# Altium project TAUV-Interfacer.PrjPCB (part 2 of 2)

## Sheet Interface.SchDoc
size A; SheetNumber: 2
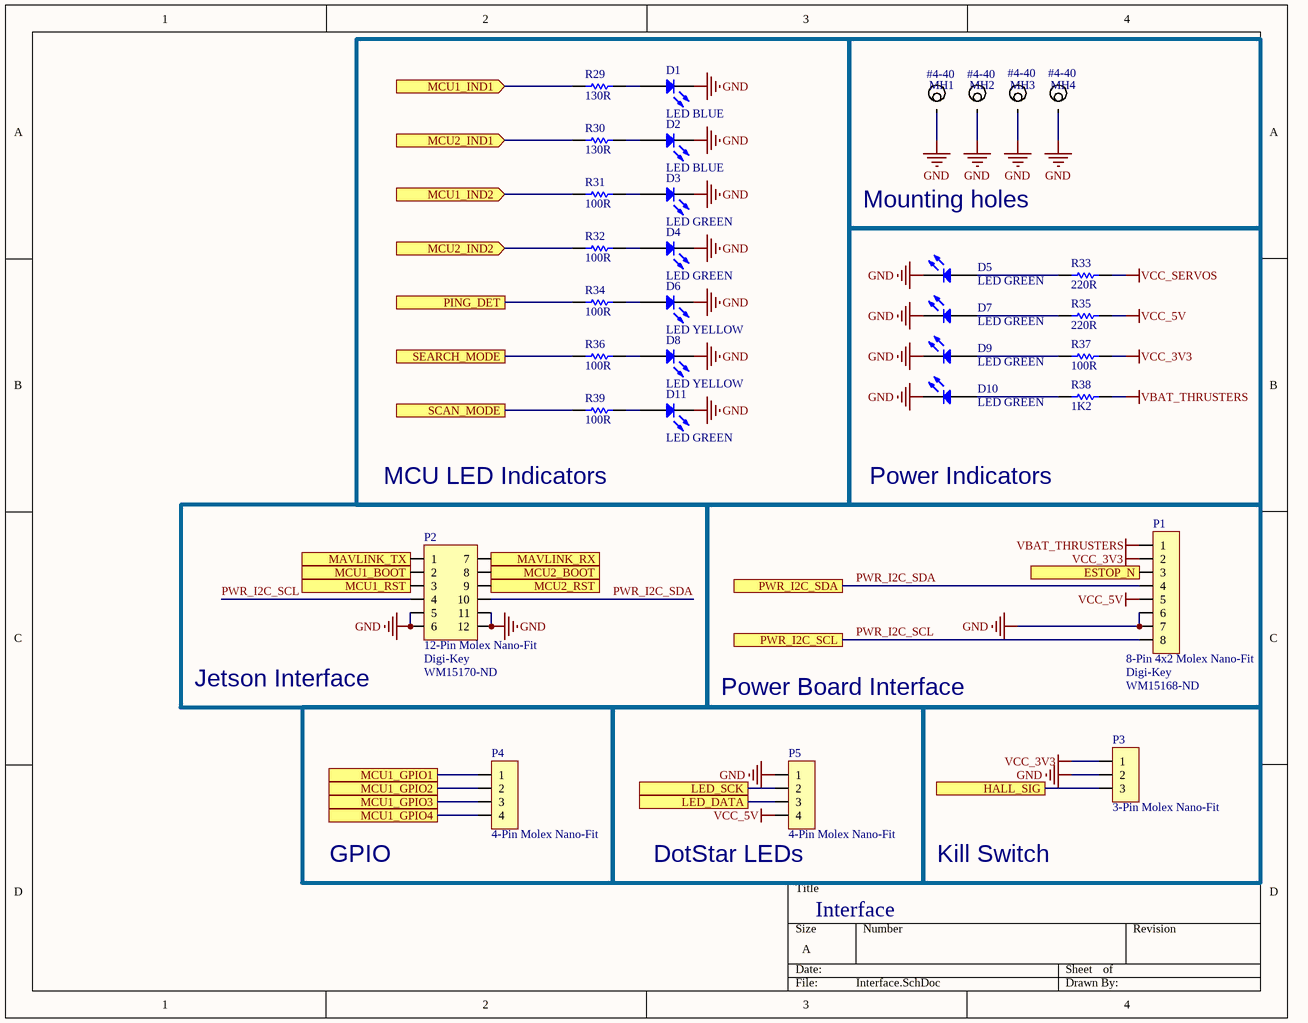
[diagram p9: Interface.SchDoc]

### Parts
D1  LED BLUE  [LED_0805]
D2  LED BLUE  [LED_0805]
D3  LED GREEN  [LED_0805]
D4  LED GREEN  [LED_0805]
D5  LED GREEN  [LED_0805]
D6  LED YELLOW  [LED_0805]
D7  LED GREEN  [LED_0805]
D8  LED YELLOW  [LED_0805]
D9  LED GREEN  [LED_0805]
D10  LED GREEN  [LED_0805]
D11  LED GREEN  [LED_0805]
MH1  #4-40  [Mounting Hole #4-40]
MH2  #4-40  [Mounting Hole #4-40]
MH3  #4-40  [Mounting Hole #4-40]
MH4  #4-40  [Mounting Hole #4-40]
P1  8-Pin 4x2 Molex Nano-Fit  Supplier 1: Digi-Key  Supplier Part Number 1: WM15168-ND  [MOLEX NANO-FIT 2x4]
P2  12-Pin Molex Nano-Fit  Supplier 1: Digi-Key  Supplier Part Number 1: WM15170-ND  [MOLEX NANO-FIT 2X6 - Right Angle]
P3  3-Pin Molex Nano-Fit  [MOLEX NANO-FIT 1X3]
P4  4-Pin Molex Nano-Fit  [MOLEX NANO-FIT 1X4]
P5  4-Pin Molex Nano-Fit  [MOLEX NANO-FIT 1X4]
R29  130R  [RESC0603(1608)_N]
R30  130R  [RESC0603(1608)_N]
R31  100R  [RESC0603(1608)_N]
R32  100R  [RESC0603(1608)_N]
R33  220R  [RESC0603(1608)_N]
R34  100R  [RESC0603(1608)_N]
R35  220R  [RESC0603(1608)_N]
R36  100R  [RESC0603(1608)_N]
R37  100R  [RESC0603(1608)_N]
R38  1K2  [RESC0603(1608)_N]
R39  100R  [RESC0603(1608)_N]

### Blocks framed on the sheet
MCU LED Indicators: D1-D4 D6 D8 D11 R29-R32 R34 R36 R39
Mounting holes: MH1-MH4
Power Indicators: D5 D7 D9 D10 R33 R35 R37 R38
GPIO: P4
Kill Switch: P3

### Ports
ESTOP_N, HALL_SIG, LED_DATA, LED_SCK, MAVLINK_RX, MAVLINK_TX, MCU1_BOOT (in), MCU1_GPIO1, MCU1_GPIO2, MCU1_GPIO3, MCU1_GPIO4, MCU1_IND1 (in), MCU1_IND2 (in), MCU1_RST (in), MCU2_BOOT (in), MCU2_IND1 (in), MCU2_IND2 (in), MCU2_RST (in), PING_DET, PWR_I2C_SCL, PWR_I2C_SDA, SCAN_MODE, SEARCH_MODE

### Nets
GND: D1.1(K) D2.1(K) D3.1(K) D4.1(K) D5.1(K) D6.1(K) D7.1(K) D8.1(K) D9.1(K) D10.1(K) D11.1(K) MH1.0 MH2.0 MH3.0 MH4.0 P1.6 P1.7 P2.5 P2.6 P2.11 P2.12 P3.2 P5.1
VBAT_THRUSTERS: P1.1 R38.2
VCC_3V3: P1.2 P3.1 R37.2
VCC_5V: P1.5 P5.4 R35.2
VCC_SERVOS: R33.2
HALL_SENSE: P1.3 ; port ESTOP_N
IND_PING: R34.1 ; port PING_DET
IND_SCAN: R39.1 ; port SCAN_MODE
IND_SEARCH: R36.1 ; port SEARCH_MODE
MCU1_BOOT: P2.2 ; port MCU1_BOOT
MCU1_GPIO1: P4.1 ; port MCU1_GPIO1
MCU1_GPIO2: P4.2 ; port MCU1_GPIO2
MCU1_GPIO3: P4.3 ; port MCU1_GPIO3
MCU1_GPIO4: P4.4 ; port MCU1_GPIO4
MCU1_IND1: R29.1 ; port MCU1_IND1
MCU1_IND2: R31.1 ; port MCU1_IND2
MCU1_SPI1_MOSI: P5.3 ; port LED_DATA
MCU1_SPI1_SCK: P5.2 ; port LED_SCK
MCU1_UART4_RX: P2.7 ; port MAVLINK_RX
MCU1_UART4_TX: P2.1 ; port MAVLINK_TX
MCU2_BOOT: P2.8 ; port MCU2_BOOT
MCU2_IND1: R30.1 ; port MCU2_IND1
MCU2_IND2: R32.1 ; port MCU2_IND2
PWR_I2C_SCL: P1.8 P2.4 ; port PWR_I2C_SCL  [project net MCU1_I2C_SCL]
PWR_I2C_SDA: P1.4 P2.10 ; port PWR_I2C_SDA  [project net MCU1_I2C_SDA]
NetD1_2: D1.2(A) R29.2
NetD2_2: D2.2(A) R30.2
NetD3_2: D3.2(A) R31.2
NetD4_2: D4.2(A) R32.2
NetD5_2: D5.2(A) R33.1
NetD6_2: D6.2(A) R34.2
NetD7_2: D7.2(A) R35.1
NetD8_2: D8.2(A) R36.2
NetD9_2: D9.2(A) R37.1
NetD10_2: D10.2(A) R38.1
NetD11_2: D11.2(A) R39.2
NetP2_3: P2.3 ; port MCU1_RST
NetP2_9: P2.9 ; port MCU2_RST
NetP3_3: P3.3 ; port HALL_SIG

### Notes on the sheet
- (near P2) Jetson Interface
- Power Board Interface
- (near P5) DotStar LEDs
- Interface

### Library data of the parts
D1 D2 = LED0: led; Manufacturer 1: Kingbright; Manufacturer Part Number 1: APT2012LVBC/D; Lens Colour: Colorless; Lens Transparency: Clear; Luminous Intensity: 24mcd; Test Current: 2mA; Viewing Angle: 120°; Dominant Wavelength: 470nm; Forward Voltage: 2.65V; Supplier 1: Digi-Key; Supplier Part Number 1: 754-1938-1-ND; Stock 1: 44757; Pricing 1: 1=0.69, 10=0.541, 25=0.4508, 100=0.3885, 250=0.3469, 500=0.2983, 1000=0.2303 (USD); Mount: Surface Mount; Case/Package: 0805; Colour: Blue; Case Code (Metric): 2012; Case Code (Imperial): 0805; Packaging: Tape and Reel; Length: 2mm; Height: 0.75mm; Width: 1.25mm; Lead Free: Lead Free; ComponentLink1URL: http://www.mouser.com/ds/2/216/APT2012LVBC-D-535767.pdf; ComponentLink1Description: http://www.mouser.com/ds/2/216/APT2012LVBC-D-535767.pdf; ComponentLink2URL: http://www.kingbrightusa.com/images/catalog/SPEC/APT2012LVBC-D.pdf; ComponentLink2Description: http://www.kingbrightusa.com/images/catalog/SPEC/APT2012LVBC-D.pdf
D3-D5 D7 D9-D11 = LED0: led; Manufacturer: Lite-On Inc.; Manufacturer Part Number: LTST-C171KGKT; Lens Color: Colorless; Lens Transparency: Clear; Millicandela Rating: 35mcd; Lens Style/Size: Rectangle with Flat Top, 1.40mm x 1.25mm; Voltage - Forward (Vf) (Typ): 2V; Current - Test: 20mA; Viewing Angle: 130°; Wavelength - Dominant: 571nm; Wavelength - Peak: 574nm; Supplier 1: Digi-Key; Supplier Part Number 1: 160-1426-1-ND; RoHS: RoHS Compliant; Category: Optoelectronics; Stock 1: 350441; Pricing 1: 1=0.31, 10=0.225, 25=0.1656, 100=0.1183, 250=0.0804, 500=0.07096, 1000=0.05558 (USD); Packaging: Cut Tape (CT); Part Status: Active; Color: Green; Mounting Type: Surface Mount; Features: -; Package / Case: 0805 (2012 Metric); Size / Dimension: 2.00mm L x 1.25mm W; Height (Max): 0.90mm; ComponentLink1URL: http://optoelectronics.liteon.com/upload/download/DS22-2000-118/LTST-C171KGKT.pdf; ComponentLink1Description: http://optoelectronics.liteon.com/upload/download/DS22-2000-118/LTST-C171KGKT.pdf
D6 D8 = LED0: led / LTST-C171KSKT; Manufacturer: Lite-On Inc.; Manufacturer Part Number: LTST-C171KGKT; Color: Green; Lens Color: Colorless; Lens Transparency: Clear; Millicandela Rating: 35mcd; Lens Style/Size: Rectangle with Flat Top, 1.40mm x 1.25mm; Voltage - Forward (Vf) (Typ): 2V; Current - Test: 20mA; Viewing Angle: 130°; Wavelength - Dominant: 571nm; Wavelength - Peak: 574nm; Supplier 1: Digi-Key; Supplier Part Number 1: 160-1426-1-ND; RoHS: RoHS Compliant; Category: Optoelectronics; Stock 1: 350441; Pricing 1: 1=0.31, 10=0.225, 25=0.1656, 100=0.1183, 250=0.0804, 500=0.07096, 1000=0.05558 (USD); Packaging: Cut Tape (CT); Part Status: Active; Mounting Type: Surface Mount; Features: -; Package / Case: 0805 (2012 Metric); Size / Dimension: 2.00mm L x 1.25mm W; Height (Max): 0.90mm; ComponentLink1URL: http://optoelectronics.liteon.com/upload/download/DS22-2000-110/LTST-C171KSKT.pdf; ComponentLink1Description: http://optoelectronics.liteon.com/upload/download/DS22-2000-110/LTST-C171KSKT.pdf
MH1-MH4 = Mounting Hole #4-40, Loose Fit: Mounting Hole for ANSI #4-40 w/ Flat Washer, Loose Fit; Datasheet: http://blogs.mentor.com/tom-hausherr/blog/tag/pcb-mounting-holes/
P1 = 8-Pin 2-Row Nano-Fit: NanoFit RA Hdr TH DR 8Ckt; Part Number: 105314-1216; Supplier: Digi-Key; Manufacturer: Molex; Supplier Part Number: WM15165-ND
P2 = 12-Pin 2-Row Nano-Fit: NanoFit RA Hdr TH DR 12Ckt; ComponentLink1Description: Digikey Link; ComponentLink1URL: https://www.digikey.com/product-detail/en/molex-llc/1053141312/WM15170-ND/6164259
P3 = 3-Pin Nano-Fit: NanoFit RA Hdr TH SR 3Ckt; Part Number: 105313-1204; Supplier: Mouser; Manufacturer: Molex; Supplier Part Number: 538-105313-1204
P4 P5 = 4-Pin Nano-Fit: NanoFit RA Hdr TH SR 4Ckt; Part Number: 105313-1204; Supplier: Mouser; Manufacturer: Molex; Supplier Part Number: 538-105313-1204
R29 R30 = CMP-1012-00409-1: 130R 0.1W 1% 0603 (1608 Metric)  SMD; Case-Metric: 1608; Case-EIA: 0603; Value: 130.00 Ohm; Power: 0.1 W; Tolerance: 1 %; Technology: SMT
R31 R32 R34 R36 R37 R39 = CMP-1012-00050-1: 100R 0.1W 5% 0603 (1608 Metric)  SMD; Case-EIA: 0603; Value: 100.00 Ohm; Case-Metric: 1608; Tolerance: 5 %; Technology: SMT; Power: 0.1 W
R33 R35 = CMP-1012-00058-1: 220R 0.1W 5% 0603 (1608 Metric)  SMD; Case-EIA: 0603; Case-Metric: 1608; Value: 220.00 Ohm; Technology: SMT; Power: 0.1 W; Tolerance: 5 %
R38 = CMP-1012-00518-1: 1K2 0.1W 1% 0603 (1608 Metric)  SMD; Case-EIA: 0603; Value: 1200.00 Ohm; Case-Metric: 1608; Power: 0.1 W; Technology: SMT; Tolerance: 1 %

## Sheet Hall_Effect.SchDoc
size A; SheetNumber: 9
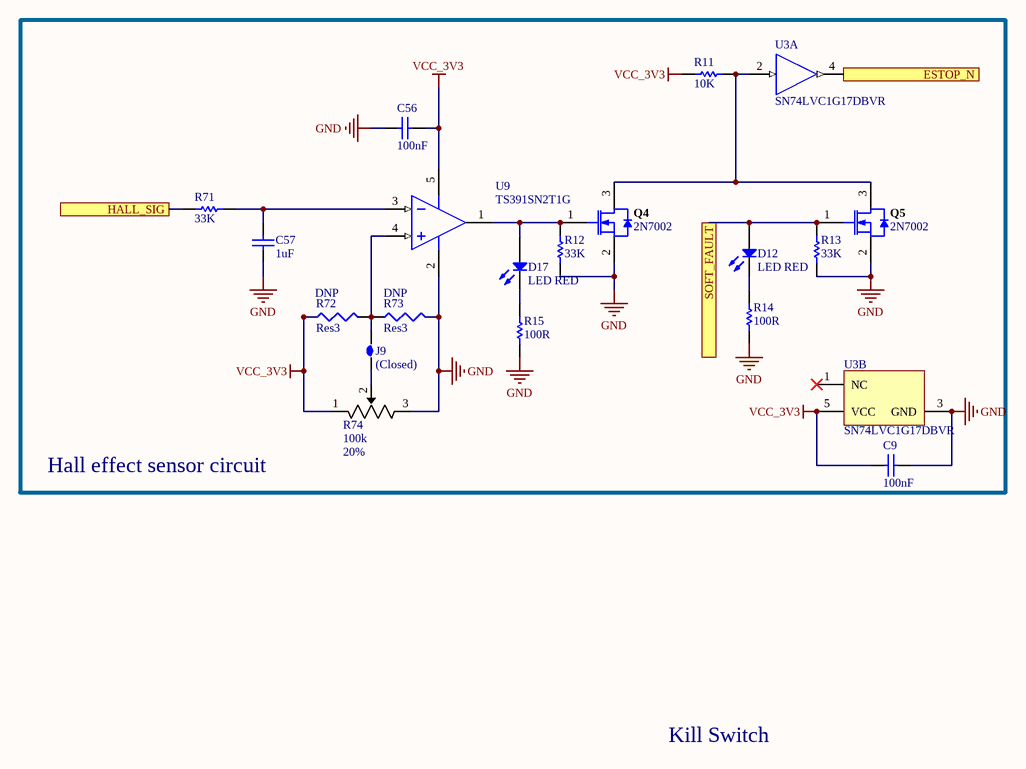
[diagram p10: Hall_Effect.SchDoc]

### Parts
(Parts that share a designator on the sheet are numbered #1, #2 ... from top to bottom, then left to right.)
C9#2  100nF  [CAPC0603(1608)100_N]
C56  100nF  [CAPC0603(1608)100_N]
C57  1uF  [CAPC0603(1608)100_N]
D12  LED RED  [LED_0805]
D17  LED RED  [LED_0805]
J9  (Closed)  [Solder Jumper - Closed]
Q4  2N7002  [INF-PG-SOT23_M]
Q5  2N7002  [INF-PG-SOT23_M]
R11#2  10K  [RESC0603(1608)_N]
R12#2  33K  [RESC0603(1608)_N]
R13#2  33K  [RESC0603(1608)_N]
R14#2  100R  [RESC0603(1608)_N]
R15#2  100R  [RESC0603(1608)_N]
R71  33K  [RESC0603(1608)_N]
R72  Res3  value DNP  [J1-0603]
R73  Res3  value DNP  [J1-0603]
R74  value 100k  Tolerance: 20%  [TT BI 22A TRIM POT]  (hidden comment: 22AR100KLFTR)
U3#2  SN74LVC1G17DBVR  [DBV0005A_M]  (parts A,B of 2)
U9  TS391SN2T1G  [ONSC-TSOP-5-483-02_V]

### Blocks framed on the sheet
Hall effect sensor circuit: C9#2 C56 C57 D12 D17 J9 Q4 Q5 R11#2 R12#2 R13#2 R14#2 R15#2 R71-R74 U3#2 U9

### Ports
ESTOP_N, HALL_SIG, SOFT_FAULT

### Nets
GND: C9#2.1 C56.2 C57.1 Q4.2(SOURCE) Q5.2(SOURCE) R12#2.2 R13#2.2 R14#2.2 R15#2.2 R73.2 R74.3 U3#2.3(GND) U9.2(VEE)
VCC_3V3: C9#2.2 C56.1 R11#2.2 R72.1 R74.1 U3#2.5(VCC) U9.5(VCC)
HALL_SENSE: U3#2.4(Y) ; port ESTOP_N
MCU1_SOFT_FAULT: D12.2(A) Q5.1(GATE) R13#2.1 ; port SOFT_FAULT
NetC57_2: C57.2 R71.2 U9.3(IN-)
NetD12_1: D12.1(K) R14#2.1
NetD17_1: D17.1(K) R15#2.1
NetD17_2: D17.2(A) Q4.1(GATE) R12#2.1 U9.1(OUT)
NetJ9_1: J9.1 R74.2
NetJ9_2: J9.2 R72.2 R73.1 U9.4(IN+)
NetP3_3: R71.1 ; port HALL_SIG
NetQ4_3: Q4.3(DRAIN) Q5.3(DRAIN) R11#2.1 U3#2.2(A)

Not connected (* = marked no-connect by the designer): U3#2 1(NC)*

### Notes on the sheet
- Kill Switch

### Library data of the parts
C9#2 C56 = CMP-1035-02580-1: as C2#1 on sheet Hydrophones; Max Thickness: 1 mm; Value: 100nF; Rated Voltage: 10 V; Technology: SMT
C57 = CMP-1035-02733-1: as C1#1 on sheet Hydrophones; Rated Voltage: 10 V; Max Thickness: 1 mm; Value: 1uF; Technology: SMT
D12 D17 = LED0: led; Manufacturer: Lite-On Inc.; Manufacturer Part Number: LTST-C171KRKT; Lens Color: Colorless; Lens Transparency: Clear; Millicandela Rating: 54mcd; Lens Style/Size: Rectangle with Flat Top, 1.40mm x 1.25mm; Voltage - Forward (Vf) (Typ): 2V; Current - Test: 20mA; Viewing Angle: 130°; Wavelength - Dominant: 631nm; Wavelength - Peak: 639nm; Supplier 1: Digi-Key; Supplier Part Number 1: 160-1427-1-ND; RoHS: RoHS Compliant; Category: Optoelectronics; Stock 1: 260544; Pricing 1: 1=0.31, 10=0.225, 25=0.1656, 100=0.1183, 250=0.0804, 500=0.07096, 1000=0.05558 (USD); Packaging: Cut Tape (CT); Part Status: Active; Color: Red; Mounting Type: Surface Mount; Features: -; Package / Case: 0805 (2012 Metric); Size / Dimension: 2.00mm L x 1.25mm W; Height (Max): 0.80mm; ComponentLink1URL: http://optoelectronics.liteon.com/upload/download/DS22-2000-109/LTST-C171KRKT.pdf; ComponentLink1Description: http://optoelectronics.liteon.com/upload/download/DS22-2000-109/LTST-C171KRKT.pdf
J9 = Jumper Closed: Jumper
Q4 Q5 = CMP-1149-00026-1: N-Channel OptiMOS Small-Signal-Transistor, 60 V VDS, 0.3 A ID, -55 to 150 degC, PG-SOT23, Reel, Green; Manufacturer: Infineon; RDS (on) (max) (@4.5V): 4,000 mOhm; VDS (max): 60 V; IDpuls (max): 1.2Â A; QG: 0.4Â nC; RDS (on) (max): 3,000 mOhm; RthJA (max): 250 K/W; ID (max): 0.3Â A; VGS(th) (max): 2.5Â V; VGS(th) (min): 1.5Â V; Green: TRUE; Ptot (max): 0.5Â W; PackageDescription: 3-Pin Small Outline Transistor Package, 2.9 x 1.3 mm Body, 0.95 mm Pitch; Halogen-free: TRUE; ComponentLink2Description: Datasheet; ComponentLink1URL: http://www.infineon.com/; Packing: Reel; DatasheetVersion: Rev. 2.4; PartNumber: 2N7002; PackageReference: PG-SOT23; PackageVersion: Apr-08; ComponentLink3URL: http://www.infineon.com/dgdl/SOT23-Package_Overview.pdf?folderId=db3a30431936bc4b0119532290053c66&fileId=db3a30431936bc4b0119533468123c85; ComponentLink1Description: Manufacturer URL; Mounting Technology: Surface Mount; ComponentLink3Description: Package Specification; ComponentLink2URL: http://www.infineon.com/dgdl/2N7002_Rev2.4.pdf?folderId=db3a3043156fd573011622e10b5c1f67&fileId=db3a304319bc939a0119c2a9461e79e6
R11#2 = CMP-1012-00098-1: 10K 0.1W 5% 0603 (1608 Metric)  SMD; Case-EIA: 0603; Value: 10000.00 Ohm; Case-Metric: 1608; Technology: SMT; Tolerance: 5 %; Power: 0.1 W
R12#2 R13#2 R71 = CMP-1012-00680-1: 33K 0.1W 1% 0603 (1608 Metric)  SMD; Case-EIA: 0603; Value: 33000.00 Ohm; Case-Metric: 1608; Tolerance: 1 %; Power: 0.1 W; Technology: SMT
R14#2 R15#2 = CMP-1012-00050-1: as R31 on sheet Interface; Tolerance: 5 %; Technology: SMT; Power: 0.1 W
R72 R73 = Res3: Resistor; Published: 8-Jun-2000; LatestRevisionDate: 29-May-2009; LatestRevisionNote: IPC-7351 Footprint Added.; PackageReference: J1-0603; Publisher: Altium Limited; PackageDescription: Chip Resistor
R74 = TT 22AR Trim Pot: TT Electronics BI 22AR100KLFTR SMT trim pot, 100k 20%; Supplier 1: Digi-Key; Supplier Part Number 1: 987-1003-1-ND; Datasheet: http://www.bitechnologies.com/pdfs/22.pdf
U3#2 = CMP-0859-00033-1: Single Schmitt-Trigger Buffer, DBV0005A, LARGE T&R; Schmitt Trigger: Yes; Output Type: CMOS; Logic: True; F @ Nom Voltage(Max)(Mhz): 150; 3-State Output: No; VCC(Max)(V): 5.5; VCC(Min)(V): 1.65; tpd @ Nom Voltage(Max)(ns): 11,6.5,5.5,5; Voltage(Nom)(V): 1.8,2.5,3.3,5; Output Drive (IOL/IOH)(Max)(mA): 32/-32; Rating: Catalog; Sub-Family: Non-Inverting Buffer/Driver; Bits(#): 1; Technology Family: LVC; Input Type: CMOS/TTL; ICC @ Nom Voltage(Max)(mA): 0.01; Operating Temperature Range(C): -40 to 125,-40 to 85; ComponentLink2URL: http://www.ti.com/lit/ds/symlink/sn74lvc1g17.pdf; PackageReference: DBV0005A; PartNumber: SN74LVC1G17DBVR; Part Number: SN74LVC1G17; ComponentLink1URL: http://www.ti.com/; DatasheetVersion: SCES351V; ComponentLink1Description: Manufacturer URL; ComponentLink2Description: Datasheet
U9 = CMP-1305-00060-1: Low Power Single Voltage Comparator, 2 to 36 V, -40 to 125 degC, 5-Pin TSOP, Pb-Free, Tape and Reel; Manufacturer: On Semiconductor; VCC Min (V): 2; VCC Max (V): 36; ICC Typ (mA): 0.5; IO Typ (mA): 16; DatasheetVersion: Rev. 3; Mounting Technology: Surface Mount; PackageVersion: Rev. K, 04/2013; ComponentLink2Description: Datasheet; ComponentLink3Description: Package Specification; ComponentLink3URL: http://www.onsemi.com/pub_link/Collateral/483.PDF; ComponentLink2URL: http://www.onsemi.com/pub_link/Collateral/TS391-D.PDF; Packing: Tape and Reel; ComponentLink1Description: Manufacturer URL; ComponentLink1URL: http://www.onsemi.com/; PackageReference: TSOP-5-483-02; PackageDescription: 5-Pin Small Outline Package, Body 3 x 1.5 mm, Pitch 0.95 mm; PartNumber: TS391SN2T1G; RoHS: TRUE

## Sheet Hydrophone.SchDoc
size A4
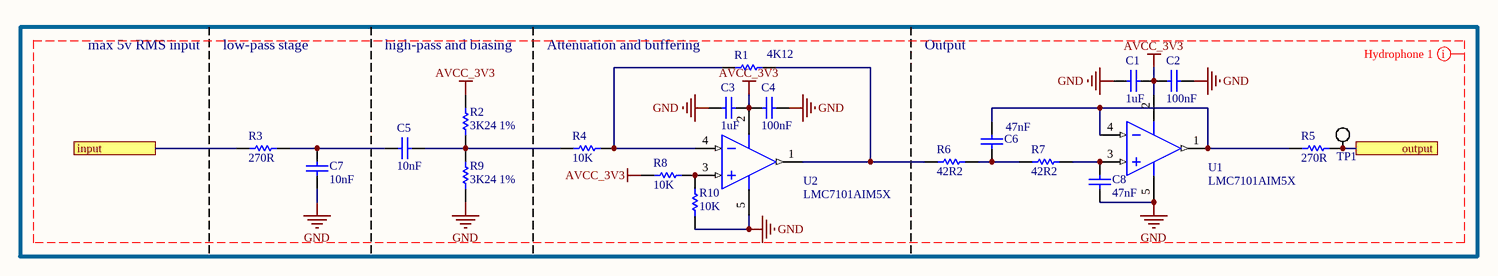
[diagram p11: Hydrophone.SchDoc]

### Parts
(Parts that share a designator on the sheet are numbered #1, #2 ... from top to bottom, then left to right.)
C1#2  1uF  [CAPC0603(1608)100_N]
C2#2  100nF  [CAPC0603(1608)100_N]
C3#2  1uF  [CAPC0603(1608)100_N]
C4#2  100nF  [CAPC0603(1608)100_N]
C5#2  10nF  [CAPC0603(1608)100_N]
C6#2  47nF  [CAPC0603(1608)100_N]
C7#2  10nF  [CAPC0603(1608)100_N]
C8#2  47nF  [CAPC0603(1608)100_N]
R1#2  4K12  [RESC0603(1608)_N]
R2#2  3K24 1%  [RESC0603(1608)_N]
R3#2  270R  [RESC0603(1608)_N]
R4#2  10K  [RESC0603(1608)_N]
R5#2  270R  [RESC0603(1608)_N]
R6#2  42R2  [RESC0603(1608)_N]
R7#2  42R2  [RESC0603(1608)_N]
R8#2  10K  [RESC0603(1608)_N]
R9#2  3K24 1%  [RESC0603(1608)_N]
R10#2  10K  [RESC0603(1608)_N]
TP1#2  Test Point Loop  [Test Point Loop - Black]  (value not drawn)
U1#2  LMC7101AIM5X  [DBV0005A_N]
U2#2  LMC7101AIM5X  [DBV0005A_N]

### Ports
input, output

### Nets
AVCC_3V3: C1#2.1 C2#2.2 C3#2.1 C4#2.2 R2#2.2 R8#2.1 U1#2.2(V+) U2#2.2(V+)
GND: C1#2.2 C2#2.1 C3#2.2 C4#2.1 C7#2.1 C8#2.1 R9#2.1 R10#2.1 U1#2.5(V-) U2#2.5(V-)
NetC5#2_1: C5#2.1 C7#2.2 R3#2.2
NetC5#2_2: C5#2.2 R2#2.1 R4#2.1 R9#2.2
NetC6#2_1: C6#2.1 R6#2.2 R7#2.1
NetC6#2_2: C6#2.2 R5#2.1 U1#2.1(OUT) U1#2.4(IN-)
NetC8#2_2: C8#2.2 R7#2.2 U1#2.3(IN+)
NetR1#2_1: R1#2.1 R4#2.2 U2#2.4(IN-)
NetR1#2_2: R1#2.2 R6#2.1 U2#2.1(OUT)
NetR3#2_1: R3#2.1 ; port input
NetR5#2_2: R5#2.2 TP1#2.1 ; port output
NetR8#2_2: R8#2.2 R10#2.2 U2#2.3(IN+)

### Layout directives
net class Hydrophone1: AVCC_3V3, GND

### Notes on the sheet
- max 5v RMS input
- low-pass stage
- high-pass and biasing
- (near R1#2) Attenuation and buffering
- Output

### Library data of the parts
C1#2 = CMP-1035-02733-1: as C1#1 on sheet Hydrophones; Rated Voltage: 10 V; Max Thickness: 1 mm; Value: 1uF; Technology: SMT
C2#2 = CMP-1035-02580-1: as C2#1 on sheet Hydrophones; Max Thickness: 1 mm; Value: 100nF; Rated Voltage: 10 V; Technology: SMT
C3#2 = CMP-1035-02733-1: CAP 1uF 10V ±10% 0603 (1608 Metric) Thickness 1mm SMD; Tolerance: Â±10%; Case-EIA: 0603; Case-Metric: 1608; ChannelOffset: 8; Rated Voltage: 10 V; Max Thickness: 1 mm; Value: 1uF; Technology: SMT
C4#2 = CMP-1035-02580-1: CAP 100nF 10V ±10% 0603 (1608 Metric) Thickness 1mm SMD; Tolerance: Â±10%; Case-EIA: 0603; Case-Metric: 1608; ChannelOffset: 9; Max Thickness: 1 mm; Value: 100nF; Rated Voltage: 10 V; Technology: SMT
C5#2 = CMP-1035-02314-1: CAP 10nF 25V ±1% 0603 (1608 Metric) Thickness 1mm SMD; Case-EIA: 0603; Tolerance: Â±1%; Case-Metric: 1608; ChannelOffset: 3; Technology: SMT; Value: 10nF; Rated Voltage: 25 V; Max Thickness: 1 mm
C6#2 C8#2 = CMP-1035-02506-1: CAP 47nF 25V ±5% 0603 (1608 Metric) Thickness 1mm SMD; Tolerance: Â±5%; Case-Metric: 1608; Case-EIA: 0603; Max Thickness: 1 mm; Rated Voltage: 25 V; Value: 47nF; Technology: SMT
C7#2 = CMP-1035-02314-1: CAP 10nF 25V ±1% 0603 (1608 Metric) Thickness 1mm SMD; Case-EIA: 0603; Tolerance: Â±1%; Case-Metric: 1608; ChannelOffset: 2; Technology: SMT; Value: 10nF; Rated Voltage: 25 V; Max Thickness: 1 mm
R1#2 = CMP-1012-00579-1: 4K12 0.1W 1% 0603 (1608 Metric)  SMD; Case-EIA: 0603; Value: 4120.00 Ohm; Case-Metric: 1608; Technology: SMT; Tolerance: 1 %; Power: 0.1 W; Parameter 1: *
R2#2 = CMP-1012-00566-1: 3K24 0.1W 1% 0603 (1608 Metric)  SMD; Value: 3240.00 Ohm; Case-Metric: 1608; Case-EIA: 0603; ChannelOffset: 3; Tolerance: 1 %; Technology: SMT; Power: 0.1 W
R3#2 = CMP-1012-00444-1: 270R 0.1W 1% 0603 (1608 Metric)  SMD; Value: 270.00 Ohm; Case-EIA: 0603; Case-Metric: 1608; ChannelOffset: 1; Technology: SMT; Power: 0.1 W; Tolerance: 1 %
R4#2 = CMP-1012-00623-1: 10K 0.1W 1% 0603 (1608 Metric)  SMD; Value: 10000.00 Ohm; Case-EIA: 0603; Case-Metric: 1608; ChannelOffset: 5; Power: 0.1 W; Tolerance: 1 %; Technology: SMT
R5#2 = CMP-1012-00444-1: as R3#1 on sheet Hydrophones; Technology: SMT; Power: 0.1 W; Tolerance: 1 %
R6#2 R7#2 = CMP-1012-00354-1: 42R2 0.1W 1% 0603 (1608 Metric)  SMD; Case-Metric: 1608; Case-EIA: 0603; Value: 42.20 Ohm; Tolerance: 1 %; Power: 0.1 W; Technology: SMT
R8#2 R10#2 = CMP-1012-00623-1: 10K 0.1W 1% 0603 (1608 Metric)  SMD; Value: 10000.00 Ohm; Case-EIA: 0603; Case-Metric: 1608; ChannelOffset: 6; Power: 0.1 W; Tolerance: 1 %; Technology: SMT
R9#2 = CMP-1012-00566-1: 3K24 0.1W 1% 0603 (1608 Metric)  SMD; Value: 3240.00 Ohm; Case-Metric: 1608; Case-EIA: 0603; ChannelOffset: 4; Tolerance: 1 %; Technology: SMT; Power: 0.1 W
TP1#2 = Test Point Loop: Keyston Electronics 5001 Test Point Loop; Manufacturer P/N: 5001; Manufacturer: Keystone Electronics; Color: Black; Supplier 1: Digi-Key; Supplier Part Number 1: 36-5001-ND
U1#2 = CMP-0055-01331-3: as U1#1 on sheet Hydrophones; Package Reference: DBV0005A; ComponentLink1URL: http://www.ti.com/general/docs/lit/getliterature.tsp?genericPartNumber=LMC7101&fileType=pdf; ComponentLink1Description: Datasheet URL; RoHS: N; PackageDescription: Molded SOT-23, .115 x .063 x .040 in Body, 5 Lead, .0375 in Pitch; PinCount: 5
U2#2 = CMP-0055-01331-3: Tiny Low Power Operational Amplifier with Rail-to-Rail Input and Output, 5-pin SOT-23; Manufacturer: Texas Instruments; CompType: Amplifiers; PowerWise: N; PackageTopMarking: A00A*XTT; ChannelOffset: 7; Package Reference: DBV0005A; ComponentLink1URL: http://www.ti.com/general/docs/lit/getliterature.tsp?genericPartNumber=LMC7101&fileType=pdf; ComponentLink1Description: Datasheet URL; RoHS: N; PackageDescription: Molded SOT-23, .115 x .063 x .040 in Body, 5 Lead, .0375 in Pitch; PinCount: 5

## Nets that join several sheets
AVCC_3V3: Hydrophones (20 pins), MCU_Powers (C43.2 C44.2 R52.1 U5.21), Power (C53.1 FB1.2), Hydrophone (8 pins)
GND: Hydrophones (25 pins), MCU_Hydro (16 pins), MCU_Main (16 pins), SD (16 pins), USB (14 pins), MCU_Powers (30 pins), Power (C53.2 C58.2), Servos (6 pins), Interface (23 pins), Hall_Effect (13 pins), Hydrophone (10 pins)
VBAT_THRUSTERS: Power (FB2.1), Interface (P1.1 R38.2)
VCC_3V3: MCU_Hydro (D13.2 J5.1 R42.2), MCU_Main (D15.2 J6.1 R75.2), SD (18 pins), MCU_Powers (30 pins), Power (FB1.1), Interface (P1.2 P3.1 R37.2), Hall_Effect (7 pins)
VCC_5V: Servos (C55.2 Q3.3 U8.1), Interface (P1.5 P5.4 R35.2)
VCC_HYDRO: Hydrophones (P8.5), Power (C58.1 FB2.2)
VCC_SERVOS: Servos (C54.2 Q3.2 R66.2 R67.1), Interface (R33.2)
HALL_SENSE: MCU_Main (U6.52), Servos (U8.2), Interface (P1.3), Hall_Effect (U3#2.4)
IND_PING: MCU_Hydro (U5.54), Interface (R34.1)
IND_SCAN: MCU_Hydro (U5.52), Interface (R39.1)
IND_SEARCH: MCU_Hydro (U5.53), Interface (R36.1)
MCU1_BOOT: MCU_Main (D16.2 R50.1 U6.94), Interface (P2.2)
MCU1_GPIO1: MCU_Main (U6.55), Interface (P4.1)
MCU1_GPIO2: MCU_Main (U6.56), Interface (P4.2)
MCU1_GPIO3: MCU_Main (U6.57), Interface (P4.3)
MCU1_GPIO4: MCU_Main (U6.58), Interface (P4.4)
MCU1_I2C_SCL: MCU_Main (U6.46), Interface (P1.8 P2.4)
MCU1_I2C_SDA: MCU_Main (U6.47), Interface (P1.4 P2.10)
MCU1_IND1: MCU_Main (U6.61), Interface (R29.1)
MCU1_IND2: MCU_Main (U6.62), Interface (R31.1)
MCU1_PWM0: MCU_Main (U6.39), Servos (P7.10)
MCU1_PWM1: MCU_Main (U6.41), Servos (P7.4)
MCU1_PWM2: MCU_Main (U6.43), Servos (P7.9)
MCU1_PWM3: MCU_Main (U6.44), Servos (P7.3)
MCU1_PWM4: MCU_Main (U6.34), Servos (P7.11)
MCU1_PWM5: MCU_Main (U6.35), Servos (P7.5)
MCU1_SD_CK: MCU_Main (U6.80), SD (CD1.5)
MCU1_SD_CMD: MCU_Main (U6.83), SD (CD1.3 R56.1)
MCU1_SD_D0: MCU_Main (U6.65), SD (CD1.7 R57.1)
MCU1_SD_D1: MCU_Main (U6.66), SD (CD1.8 R58.1)
MCU1_SD_D2: MCU_Main (U6.78), SD (CD1.1 R54.1)
MCU1_SD_D3: MCU_Main (U6.79), SD (CD1.2 R55.1)
MCU1_SD_DETECT: MCU_Main (U6.64), SD (CD1.9 R59.1)
MCU1_SOFT_FAULT: MCU_Main (U6.33), Hall_Effect (D12.2 Q5.1 R13#2.1)
MCU1_SPI1_MOSI: MCU_Main (U6.31), Interface (P5.3)
MCU1_SPI1_SCK: MCU_Main (U6.29), Interface (P5.2)
MCU1_UART4_RX: MCU_Main (U6.23), Interface (P2.7)
MCU1_UART4_TX: MCU_Main (U6.22), Interface (P2.1)
MCU1_USB_DM: MCU_Main (U6.70), USB (J7.2)
MCU1_USB_DP: MCU_Main (U6.71), USB (J7.3)
MCU2_ADC1_IN10: Hydrophones (R76.2 TP1#1.1), MCU_Hydro (U5.15)
MCU2_ADC1_IN11: Hydrophones (R77.2 TP2.1), MCU_Hydro (U5.16)
MCU2_ADC1_IN12: Hydrophones (R78.2 TP3.1), MCU_Hydro (U5.17)
MCU2_ADC1_IN13: Hydrophones (R79.2 TP4.1), MCU_Hydro (U5.18)
MCU2_BOOT: MCU_Hydro (D14.2 R45.1 U5.94), Interface (P2.8)
MCU2_IND1: MCU_Hydro (U5.61), Interface (R30.1)
MCU2_IND2: MCU_Hydro (U5.62), Interface (R32.1)
MCU2_SD_CK: MCU_Hydro (U5.80), SD (CD2.5)
MCU2_SD_CMD: MCU_Hydro (U5.83), SD (CD2.3 R62.1)
MCU2_SD_D0: MCU_Hydro (U5.65), SD (CD2.7 R63.1)
MCU2_SD_D1: MCU_Hydro (U5.66), SD (CD2.8 R64.1)
MCU2_SD_D2: MCU_Hydro (U5.78), SD (CD2.1 R60.1)
MCU2_SD_D3: MCU_Hydro (U5.79), SD (CD2.2 R61.1)
MCU2_SD_DETECT: MCU_Hydro (U5.64), SD (CD2.9 R65.1)
MCU2_USART2_RX: MCU_Hydro (U5.25), MCU_Main (P6.3)
MCU2_USART2_TX: MCU_Hydro (U5.24), MCU_Main (P6.4)
MCU2_USB_DM: MCU_Hydro (U5.70), USB (J8.2)
MCU2_USB_DP: MCU_Hydro (U5.71), USB (J8.3)
NetP2_3: MCU_Main (Q2.1 R49.1), Interface (P2.3)
NetP2_9: MCU_Hydro (Q1.1 R44.1), Interface (P2.9)
NetP3_3: Interface (P3.3), Hall_Effect (R71.1)